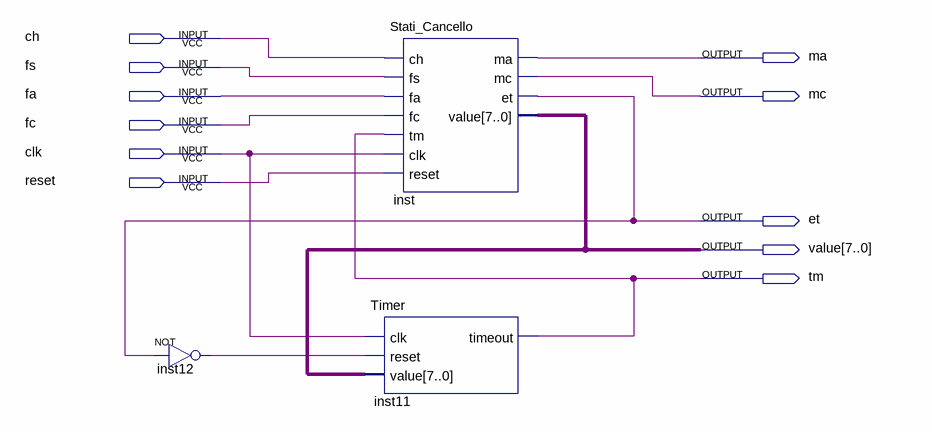
[diagram p0: schematic sheet]
// Quartus schematic Apricancello.bdf as structural Verilog: 3 symbols, 11 pins
module Apricancello (
  input  ch,
  input  fs,
  input  fa,
  input  fc,
  input  clk,
  input  reset,
  output ma,
  output mc,
  output et,
  output [7:0] value,
  output tm
);

  wire inst12_out;

  not inst12 (inst12_out, et);
  Stati_Cancello inst (
    .ch(ch), .fs(fs), .fa(fa), .fc(fc), .tm(tm), .clk(clk), .reset(reset), .ma(ma), .mc(mc), .et(et),
    .value(value));
  Timer inst11 (.clk(clk), .reset(inst12_out), .value(value), .timeout(tm));
endmodule
